# Altium schematic sheet [02] - BLOCK DIAGRAM.SchDoc: BLOCK DIAGRAM
size 433 x 279 mm; Author: ZAG; DrawnBy: ZAG; DocumentNumber: 3; SheetNumber: 2; SheetTotal: 7; PageSetup: Record=PageOptions|CenterHorizontal=True|CenterVertical=True|PrintScale=0.96|XCorrection=1.00|YCorrection=1.00|PrintKind=2|BorderSize=5000000|LeftOffset=0|BottomOffset=0|Orientation=2|PaperLength=4318|PaperWidth=2794|Scale=100|PaperSource=15|PrintQuality=600|MediaType=1|DitherType=10|PaperKind=11x17|PrintScaleMode=1; SchRevision: 01; PCBRevision: 01; Project: YOUTUBE SUBSCRIBER COUNTER; SchStatus: PRELIMINARY; ClientCompanyName: Mule Labs, LLC; ClientContactEmail: zack@mule-labs.com
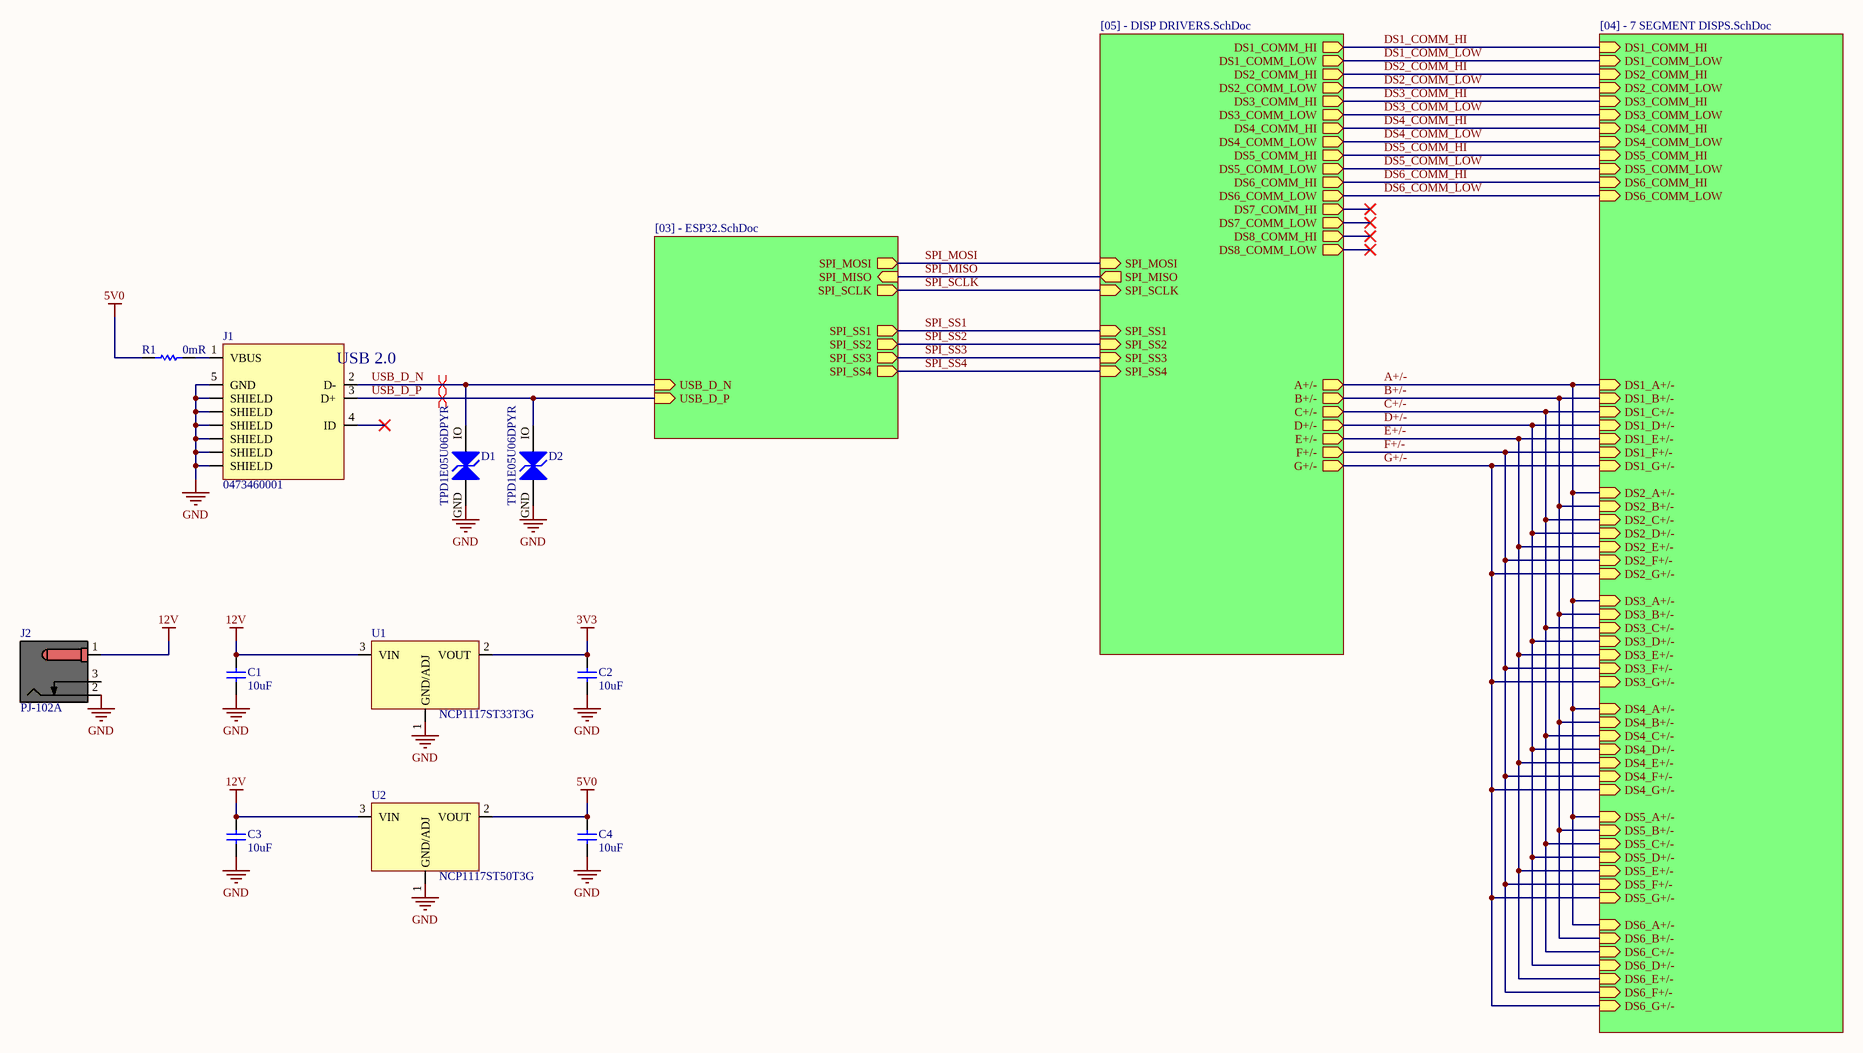
[diagram p0: [02] - BLOCK DIAGRAM.SchDoc]

## Parts
C1  10uF  [INCH 0805 - METRIC 2012 - H140]
C2  10uF  [INCH 0805 - METRIC 2012 - H140]
C3  10uF  [INCH 0805 - METRIC 2012 - H140]
C4  10uF  [INCH 0805 - METRIC 2012 - H140]
D1  TPD1E05U06DPYR  [DIODFN100X60X50-2]
D2  TPD1E05U06DPYR  [DIODFN100X60X50-2]
J1  0473460001  [MOLEX_047346-0001]
J2  PJ-102A  [CUI_PJ-102A]
R1  0mR  [INCH 0603 - METRIC 1508 - H050]
U1  NCP1117ST33T3G  [SOT223-4P230_700X180L90X70]
U2  NCP1117ST50T3G  [SOT223-4P230_700X180L90X70]

## Sub-sheets
7 Segment Displays = [04] - 7 SEGMENT DISPS.SchDoc: DS1_G+/- (in), DS1_F+/- (in), DS3_G+/- (in), DS4_G+/- (in), DS1_A+/- (in), DS5_D+/- (in), DS2_D+/- (in), DS6_A+/- (in), DS5_G+/- (in), DS6_C+/- (in), DS6_E+/- (in), DS1_E+/- (in), DS2_A+/- (in), DS3_B+/- (in), DS6_G+/- (in), DS6_F+/- (in), DS2_E+/- (in), DS4_F+/- (in), DS4_B+/- (in), DS6_D+/- (in), DS4_E+/- (in), DS3_A+/- (in), DS3_F+/- (in), DS5_C+/- (in), DS2_G+/- (in), DS2_F+/- (in), DS3_C+/- (in), DS6_B+/- (in), DS1_B+/- (in), DS2_C+/- (in), DS3_D+/- (in), DS3_E+/- (in), DS1_C+/- (in), DS5_F+/- (in), DS5_B+/- (in), DS5_A+/- (in), DS5_E+/- (in), DS2_B+/- (in), DS4_A+/- (in), DS1_D+/- (in), DS4_C+/- (in), DS4_D+/- (in), DS2_COMM_HI (in), DS5_COMM_HI (in), DS1_COMM_HI (in), DS4_COMM_LOW (in), DS1_COMM_LOW (in), DS3_COMM_LOW (in), DS4_COMM_HI (in), DS5_COMM_LOW (in), DS6_COMM_HI (in), DS2_COMM_LOW (in), DS6_COMM_LOW (in), DS3_COMM_HI (in)
Display Drivers = [05] - DISP DRIVERS.SchDoc: SPI_SS3 (in), SPI_SS4 (in), SPI_MOSI (in), SPI_SS1 (in), SPI_SCLK (in), SPI_MISO (out), SPI_SS2 (in), G+/- (out), B+/- (out), C+/- (out), F+/- (out), A+/- (out), E+/- (out), D+/- (out), DS5_COMM_LOW (out), DS3_COMM_LOW (out), DS6_COMM_LOW (out), DS7_COMM_HI (out), DS3_COMM_HI (out), DS2_COMM_LOW (out), DS4_COMM_HI (out), DS5_COMM_HI (out), DS8_COMM_HI (out), DS2_COMM_HI (out), DS8_COMM_LOW (out), DS7_COMM_LOW (out), DS6_COMM_HI (out), DS1_COMM_LOW (out), DS4_COMM_LOW (out), DS1_COMM_HI (out)
ESP32 = [03] - ESP32.SchDoc: USB_D_N (in), USB_D_P (in), SPI_SS4 (out), SPI_SS3 (out), SPI_SS2 (out), SPI_SS1 (out), SPI_SCLK (out), SPI_MISO (in), SPI_MOSI (out)

## Nets
3V3: C2.1 U1.2(VOUT)
5V0: C4.1 R1.1 U2.2(VOUT)
12V: C1.1 C3.1 J2.1 U1.3(VIN) U2.3(VIN)
GND: C1.2 C2.2 C3.2 C4.2 D1.GND D2.GND J1.0(SHIELD) J1.5(GND) J2.2 U1.1(GND/ADJ) U2.1(GND/ADJ)
A+/-: sheet Display Drivers/A+/-, sheet 7 Segment Displays/DS1_A+/-, sheet 7 Segment Displays/DS6_A+/-, sheet 7 Segment Displays/DS2_A+/-, sheet 7 Segment Displays/DS3_A+/-, sheet 7 Segment Displays/DS5_A+/-, sheet 7 Segment Displays/DS4_A+/-
B+/-: sheet Display Drivers/B+/-, sheet 7 Segment Displays/DS3_B+/-, sheet 7 Segment Displays/DS4_B+/-, sheet 7 Segment Displays/DS6_B+/-, sheet 7 Segment Displays/DS1_B+/-, sheet 7 Segment Displays/DS5_B+/-, sheet 7 Segment Displays/DS2_B+/-
C+/-: sheet Display Drivers/C+/-, sheet 7 Segment Displays/DS6_C+/-, sheet 7 Segment Displays/DS5_C+/-, sheet 7 Segment Displays/DS3_C+/-, sheet 7 Segment Displays/DS2_C+/-, sheet 7 Segment Displays/DS1_C+/-, sheet 7 Segment Displays/DS4_C+/-
D+/-: sheet Display Drivers/D+/-, sheet 7 Segment Displays/DS5_D+/-, sheet 7 Segment Displays/DS2_D+/-, sheet 7 Segment Displays/DS6_D+/-, sheet 7 Segment Displays/DS3_D+/-, sheet 7 Segment Displays/DS1_D+/-, sheet 7 Segment Displays/DS4_D+/-
DS1_COMM_HI: sheet Display Drivers/DS1_COMM_HI, sheet 7 Segment Displays/DS1_COMM_HI
DS1_COMM_LOW: sheet Display Drivers/DS1_COMM_LOW, sheet 7 Segment Displays/DS1_COMM_LOW
DS2_COMM_HI: sheet Display Drivers/DS2_COMM_HI, sheet 7 Segment Displays/DS2_COMM_HI
DS2_COMM_LOW: sheet Display Drivers/DS2_COMM_LOW, sheet 7 Segment Displays/DS2_COMM_LOW
DS3_COMM_HI: sheet Display Drivers/DS3_COMM_HI, sheet 7 Segment Displays/DS3_COMM_HI
DS3_COMM_LOW: sheet Display Drivers/DS3_COMM_LOW, sheet 7 Segment Displays/DS3_COMM_LOW
DS4_COMM_HI: sheet Display Drivers/DS4_COMM_HI, sheet 7 Segment Displays/DS4_COMM_HI
DS4_COMM_LOW: sheet Display Drivers/DS4_COMM_LOW, sheet 7 Segment Displays/DS4_COMM_LOW
DS5_COMM_HI: sheet Display Drivers/DS5_COMM_HI, sheet 7 Segment Displays/DS5_COMM_HI
DS5_COMM_LOW: sheet Display Drivers/DS5_COMM_LOW, sheet 7 Segment Displays/DS5_COMM_LOW
DS6_COMM_HI: sheet Display Drivers/DS6_COMM_HI, sheet 7 Segment Displays/DS6_COMM_HI
DS6_COMM_LOW: sheet Display Drivers/DS6_COMM_LOW, sheet 7 Segment Displays/DS6_COMM_LOW
E+/-: sheet Display Drivers/E+/-, sheet 7 Segment Displays/DS6_E+/-, sheet 7 Segment Displays/DS1_E+/-, sheet 7 Segment Displays/DS2_E+/-, sheet 7 Segment Displays/DS4_E+/-, sheet 7 Segment Displays/DS3_E+/-, sheet 7 Segment Displays/DS5_E+/-
F+/-: sheet Display Drivers/F+/-, sheet 7 Segment Displays/DS1_F+/-, sheet 7 Segment Displays/DS6_F+/-, sheet 7 Segment Displays/DS4_F+/-, sheet 7 Segment Displays/DS3_F+/-, sheet 7 Segment Displays/DS2_F+/-, sheet 7 Segment Displays/DS5_F+/-
G+/-: sheet Display Drivers/G+/-, sheet 7 Segment Displays/DS1_G+/-, sheet 7 Segment Displays/DS3_G+/-, sheet 7 Segment Displays/DS4_G+/-, sheet 7 Segment Displays/DS5_G+/-, sheet 7 Segment Displays/DS6_G+/-, sheet 7 Segment Displays/DS2_G+/-
SPI_MISO: sheet ESP32/SPI_MISO, sheet Display Drivers/SPI_MISO
SPI_MOSI: sheet ESP32/SPI_MOSI, sheet Display Drivers/SPI_MOSI
SPI_SCLK: sheet ESP32/SPI_SCLK, sheet Display Drivers/SPI_SCLK
SPI_SS1: sheet ESP32/SPI_SS1, sheet Display Drivers/SPI_SS1
SPI_SS2: sheet ESP32/SPI_SS2, sheet Display Drivers/SPI_SS2
SPI_SS3: sheet ESP32/SPI_SS3, sheet Display Drivers/SPI_SS3
SPI_SS4: sheet ESP32/SPI_SS4, sheet Display Drivers/SPI_SS4
USB_D_N: D1.IO J1.2(D-) ; sheet ESP32/USB_D_N
USB_D_P: D2.IO J1.3(D+) ; sheet ESP32/USB_D_P
NetJ1_1: J1.1(VBUS) R1.2

Not connected (* = marked no-connect by the designer): J1 4(ID)*; J2 3

## Layout directives
differential pair; differential pair class DIFF90: USB_D_N, USB_D_P

## Notes on the sheet
- SHEET TITLE
- SCH REV:
- PROJECT NAME
- PCB REV:
- DATE:
- DRAWN BY
- CONTACT
- MANUFACTURER, OR SALE OF PROCESSES OR PRODUCTS WITHOUT THE EXPRESSED WRITTEN CONSENT OF
- THE INFORMATION CONTAINED HEREIN IS DEEMED TO BE CONFIDENTIAL, PROPRIETARY, AND A TRADE SECRET OF
- THIS INFORMATION MAY NOT BE USED, REPRODUCED, OR DISCLOSED AS THE DIRECT OR INDIRECT BASIS FOR THE DEVELOPMENT,
- SHEET
- MULE LABS, LLC
- www.mule-labs.com <http://www.mule-labs.com>
- OF
- SIZE: B
- DO NOT SCALE DRAWING
- (in symbol 0473460001) USB 2.0

## Library data of the parts
C1-C4 = GRM21BR61E106MA73L: CAP CER 10UF 25V X5R 0805; Manufacturer: Murata; Tolerance: 20%; Supplier 1: Digi-Key; Manufacturer Part Number: GRM21BR61E106MA73L; Stock 1: 30000; Pricing 1: 1=0.27, 10=0.184, 100=0.1044, 500=0.0737, 1000=0.06449 (USD); Mount: Surface Mount; Case/Package: 0805; Weight: 0.000335oz; Case Code (Metric): 2012; Case Code (Imperial): 0805; Min Operating Temperature: -55°C; Max Operating Temperature: 85°C; Capacitance: 10uF; Packaging: Tape and Reel; Dielectric: X5R; Voltage Rating: 25V; Termination: SMD/SMT; Composition: Ceramic; Voltage Rating (DC): 25V; Package Quantity: 3000; Length: 2mm; Height: 1.25mm; Width: 0.049inch; Thickness: 0.055inch; Depth: 1.25mm; REACH SVHC: No SVHC; Lead Free: Lead Free; Supplier Part Number 1: 490-10748-1-ND
D1 D2 = TPD1E05U06DPYR: TVS DIODE 5.5VWM 14VC 2X2SON; Manufacturer: Texas Instruments; Operating Supply Voltage: 5.5V; Capacitance: 0.5pF; Direction: Unidirectional; Number of Bidirectional Channels: 1; Min Breakdown Voltage: 6V; Clamping Voltage: 14V; Peak Pulse Power: 40W; Power Line Protection: Yes; Breakdown Voltage: 6.5V; Polarity: Bidirectional; Leakage Current: 10nA; Element Configuration: Single; Peak Pulse Current: 2.5A; Interface: LVDS,USB,Ethernet,HDMI,PCIe,SATA; Supplier 1: Digi-Key; Manufacturer Part Number: TPD1E05U06DPYR; Stock 1: 239066; Pricing 1: 1=0.5, 10=0.372, 100=0.2107, 500=0.13952, 1000=0.10696 (USD); Mount: Surface Mount; Number of Pins: 2; Min Operating Temperature: -40°C; Max Operating Temperature: 125°C; Packaging: Tape and Reel; Package Quantity: 10000; Reverse Standoff Voltage: 5.5V; Number of Channels: 1; Termination: SMD/SMT; Working Voltage: 5.5V; Max Power Dissipation: 40W; Length: 1.1mm; Radiation Hardening: No; REACH SVHC: No SVHC; Lead Free: Lead Free; ComponentLink1URL: https://datasheet.ciiva.com/12545/tpd1e05u06-224685-12545140.pdf; ComponentLink1Description: https://datasheet.ciiva.com/12545/tpd1e05u06-224685-12545140.pdf; ComponentLink2URL: https://datasheet.ciiva.com/26918/getdatasheetpartid-700473-26918022.pdf; ComponentLink2Description: https://datasheet.ciiva.com/26918/getdatasheetpartid-700473-26918022.pdf; ComponentLink3URL: https://datasheet.ciiva.com/6574/tpd1e05u06-6574667.pdf; ComponentLink3Description: https://datasheet.ciiva.com/6574/tpd1e05u06-6574667.pdf; Supplier Part Number 1: 296-39341-1-ND; Category: ESD Device
J1 = 0473460001: Conn Micro USB Type B RCP 5 POS 0.65mm Solder RA SMD 5 Terminal 1 Port Embossed T/R; Manufacturer: Molex; Number of Contacts: 5; Gender: Receptacle; Number of Ports: 1; Max Voltage Rating (AC): 30V; Supplier 1: Digi-Key; Manufacturer Part Number: 0473460001; Stock 1: 27309; Pricing 1: 1=1, 10=0.877, 25=0.8252, 50=0.7906, 100=0.7563, 250=0.68752, 500=0.61876, 1000=0.55 (USD); Mount: Surface Mount,Horizontal; Contact Material: Copper Alloy; Contact Plating: Nickel,Gold; Housing Material: Polymer; Number of Terminals: 5; Min Operating Temperature: -30°C; Max Operating Temperature: 85°C; Packaging: Tape and Reel; Orientation: Right Angle; Package Quantity: 1; Termination: Solder; Connector Type: USB; Length: 7.8mm; Pitch: 0.65mm; Depth: 5.43mm; Radiation Hardening: No; ComponentLink1URL: https://datasheet.ciiva.com/6731/473460001-sd-6731041.pdf; ComponentLink1Description: https://datasheet.ciiva.com/6731/473460001-sd-6731041.pdf; ComponentLink2URL: https://datasheet.ciiva.com/16545/0473460001-io-connectors-16545778.pdf; ComponentLink2Description: https://datasheet.ciiva.com/16545/0473460001-io-connectors-16545778.pdf; ComponentLink3URL: https://datasheet.ciiva.com/3094/0473460001-io-connectors-3094381.pdf; ComponentLink3Description: https://datasheet.ciiva.com/3094/0473460001-io-connectors-3094381.pdf; Supplier Part Number 1: WM17141CT-ND; Category: Connector
J2 = PJ-102A: PJ-102 Series 2 x 6.5 mm 16 V Horizontal Power Jack w/ Tapered PC Pins; Manufacturer: CUI; Gender: Male; Shielding: Unshielded; Current Rating: 2.5A; Voltage Rating: 24V; Insulation Resistance: 50MR; Number of Conductors: 2; Supplier 1: Digi-Key; Manufacturer Part Number: PJ-102A; RoHS: Yes; Stock 1: 105775; Pricing 1: 1 = 0.64000, 10 = 0.60000, 25 = 0.54000, 50 = 0.48000, 100 = 0.46000, 280 = 0.42000, 560 = 0.40000, 1120 = 0.33000, 2520 = 0.30000 (USD); Mount: Through Hole; Color: Black; Contact Material: Copper; Contact Plating: Nickel; Housing Color: Black; Housing Material: Thermoplastic; Min Operating Temperature: -25°C; Max Operating Temperature: 85°C; Package Quantity: 280; Termination: Through Hole; Connector Type: Jack; Contact Gender: Male; Orientation: Horizontal; Packaging: Bulk; Diameter: 2.1mm; Lead Free: Lead Free; Flammability Rating: UL94 V-0; Supplier Part Number 1: CP-102A-ND
R1 = ERJ-3GEY0R00V: RES SMD 0 OHM JUMPER 1/10W 0603; Manufacturer: Panasonic; Power Rating: 100mW; Voltage Rating: 75V; Tolerance: 0%; Temperature Coefficient: 600ppm/°C; Voltage Rating (DC): 50V; Supplier 1: Digi-Key; Manufacturer Part Number: ERJ-3GEY0R00V; Stock 1: 29334421; Pricing 1: 1=0.1, 10=0.04, 25=0.0292, 50=0.0222, 100=0.0164, 250=0.01252, 500=0.01002, 1000=0.00737 (USD); Mount: Surface Mount; Case/Package: 0603; Contact Plating: Tin; Case Code (Metric): 1608; Case Code (Imperial): 0603; Min Operating Temperature: -55°C; Max Operating Temperature: 155°C; Resistance: 0mR; Composition: Thick Film; Packaging: Tape and Reel; Package Quantity: 1; Number of Terminations: 2; Termination: SMD/SMT; Military Standard: Not; Max Power Dissipation: 100mW; Length: 1.6mm; Height: 0.45mm; Width: 0.031inch; Depth: 0.8mm; Radiation Hardening: No; REACH SVHC: No SVHC; Lead Free: Lead Free; ComponentLink1URL: https://datasheet.ciiva.com/48532/aoa0000ce1-48532165.pdf; ComponentLink1Description: https://datasheet.ciiva.com/48532/aoa0000ce1-48532165.pdf; ComponentLink2URL: https://datasheet.ciiva.com/43460/1678796-43460647.pdf; ComponentLink2Description: https://datasheet.ciiva.com/43460/1678796-43460647.pdf; ComponentLink3URL: https://datasheet.ciiva.com/27055/1935748-27055113.pdf; ComponentLink3Description: https://datasheet.ciiva.com/27055/1935748-27055113.pdf; ComponentLink4URL: https://datasheet.ciiva.com/28695/1678796-28695833.pdf; ComponentLink4Description: https://datasheet.ciiva.com/28695/1678796-28695833.pdf; ComponentLink5URL: https://datasheet.ciiva.com/5959/1678796-5959707.pdf; ComponentLink5Description: https://datasheet.ciiva.com/5959/1678796-5959707.pdf; ComponentLink6URL: https://datasheet.ciiva.com/16834/aoa0000ce1-16834828.pdf; ComponentLink6Description: https://datasheet.ciiva.com/16834/aoa0000ce1-16834828.pdf; ComponentLink7URL: https://datasheet.ciiva.com/17215/aoa0000ce1-17215388.pdf; ComponentLink7Description: https://datasheet.ciiva.com/17215/aoa0000ce1-17215388.pdf; ComponentLink8URL: https://datasheet.ciiva.com/46377/1678796-46377868.pdf; ComponentLink8Description: https://datasheet.ciiva.com/46377/1678796-46377868.pdf; ComponentLink9URL: https://datasheet.ciiva.com/30199/4aoa0000ce1-30199822.pdf; ComponentLink9Description: https://datasheet.ciiva.com/30199/4aoa0000ce1-30199822.pdf; ComponentLink10URL: https://datasheet.ciiva.com/9198/aoa0000ce1-9198975.pdf; ComponentLink10Description: https://datasheet.ciiva.com/9198/aoa0000ce1-9198975.pdf; ComponentLink11URL: https://datasheet.ciiva.com/11808/0900766b80f806dd-11808207.pdf; ComponentLink11Description: https://datasheet.ciiva.com/11808/0900766b80f806dd-11808207.pdf; ComponentLink12URL: https://datasheet.ciiva.com/16758/70255313-16758527.pdf; ComponentLink12Description: https://datasheet.ciiva.com/16758/70255313-16758527.pdf; Supplier Part Number 1: P0.0GCT-ND; Category: Resistor
U1 = NCP1117ST33T3G: IC REG LINEAR 3.3V 1A SOT223; Manufacturer: ON Semiconductor; Max Input Voltage: 20V; Number of Outputs: 1; Dropout Voltage: 1.07V; Max Supply Voltage: 15V; Min Supply Voltage: 4.75V; Min Input Voltage: 3.5V; Input Bias Current: 6mA; Quiescent Current: 10mA; Polarity: Positive; Reference Voltage: 1.25V; Accuracy: 1%; Output Type: Fixed; Supplier 1: Digi-Key; Manufacturer Part Number: NCP1117ST33T3G; RoHS: Yes; Stock 1: 60671; Pricing 1: 1 = 0.52000, 10 = 0.44400, 100 = 0.33150, 500 = 0.26048, 1000 = 0.20129 (USD); Mount: Surface Mount; Case/Package: SOT-223; Number of Pins: 3; Contact Plating: Tin; Min Operating Temperature: 0°C; Max Operating Temperature: 125°C; Output Voltage: 3.3V; Packaging: Tape and Reel; Output Current: 1A; Max Output Current: 1A; Package Quantity: 1; Nominal Output Voltage: 3.3V; Number of Regulators: 1; Min Current Limit: 1A; Min Output Voltage: 3.3V; Max Output Voltage: 3.3V; Termination: SMD/SMT; Output Voltage Accuracy: 1%; Length: 6.7mm; Height: 1.69mm; Width: 3.7mm; Radiation Hardening: No; REACH SVHC: No SVHC; Lead Free: Lead Free; Halogen Free: Halogen Free; ComponentLink1URL: https://datasheet.ciiva.com/3224/ncp1117-d-3224144.pdf?src-supplier=Avnet; ComponentLink1Description: https://datasheet.ciiva.com/3224/ncp1117-d-3224144.pdf?src-supplier=Avnet; ComponentLink2URL: https://datasheet.ciiva.com/22697/1726422-22697602.pdf?src-supplier=Element14; ComponentLink2Description: https://datasheet.ciiva.com/22697/1726422-22697602.pdf?src-supplier=Element14; ComponentLink3URL: https://datasheet.ciiva.com/15111/getdatasheetpartid-82718-15111483.pdf?src-supplier=Verical; ComponentLink3Description: https://datasheet.ciiva.com/15111/getdatasheetpartid-82718-15111483.pdf?src-supplier=Verical; ComponentLink4URL: https://datasheet.ciiva.com/8233/ncp1117-d-8233589.pdf?src-supplier=Avnet; ComponentLink4Description: https://datasheet.ciiva.com/8233/ncp1117-d-8233589.pdf?src-supplier=Avnet; ComponentLink5URL: https://datasheet.ciiva.com/2042/ncp1117-d-2042027.pdf?src-supplier=Digi-Key; ComponentLink5Description: https://datasheet.ciiva.com/2042/ncp1117-d-2042027.pdf?src-supplier=Digi-Key; ComponentLink6URL: https://datasheet.ciiva.com/2042/ncp1117-d-2042028.pdf?src-supplier=Digi-Key; ComponentLink6Description: https://datasheet.ciiva.com/2042/ncp1117-d-2042028.pdf?src-supplier=Digi-Key; ComponentLink7URL: https://datasheet.ciiva.com/2042/ncp1117-d-2042029.pdf?src-supplier=Digi-Key; ComponentLink7Description: https://datasheet.ciiva.com/2042/ncp1117-d-2042029.pdf?src-supplier=Digi-Key; ComponentLink8URL: https://datasheet.ciiva.com/8073/1726422-8073735.pdf?src-supplier=Element14; ComponentLink8Description: https://datasheet.ciiva.com/8073/1726422-8073735.pdf?src-supplier=Element14; ComponentLink9URL: https://datasheet.ciiva.com/28483/1748260-28483307.pdf?src-supplier=Element14; ComponentLink9Description: https://datasheet.ciiva.com/28483/1748260-28483307.pdf?src-supplier=Element14; ComponentLink10URL: https://datasheet.ciiva.com/16382/ncp1117-d-16382636.pdf?src-supplier=Future+Electronics; ComponentLink10Description: https://datasheet.ciiva.com/16382/ncp1117-d-16382636.pdf?src-supplier=Future+Electronics; Supplier Part Number 1: NCP1117ST33T3GOSCT-ND
U2 = NCP1117ST50T3G: IC REG LINEAR 5V 1A SOT223; Manufacturer: ON Semiconductor; Number of Outputs: 1; Max Input Voltage: 20V; Min Input Voltage: 3.5V; Dropout Voltage: 1.2V; Input Bias Current: 6mA; Polarity: Positive; Quiescent Current: 10mA; Output Voltage Accuracy: 1%; Power Rating: 781mW; Output Type: Fixed; Supplier 1: Digi-Key; Manufacturer Part Number: NCP1117ST50T3G; RoHS: Yes; Stock 1: 20727; Pricing 1: 1 = 0.54000, 10 = 0.45800, 100 = 0.34230, 500 = 0.26896, 1000 = 0.20783 (USD); Case/Package: SOT-223; Number of Pins: 4; Contact Plating: Tin; Min Operating Temperature: 0°C; Max Operating Temperature: 125°C; Package Quantity: 1; Output Voltage: 5V; Output Current: 1A; Max Output Current: 1A; Nominal Output Voltage: 5V; Packaging: Tape and Reel; Number of Regulators: 1; Min Current Limit: 1A; Accuracy: 1%; Tolerance: 1%; Length: 6.7mm; Height: 1.69mm; Width: 3.7mm; Radiation Hardening: No; REACH SVHC: No SVHC; Lead Free: Lead Free; Halogen Free: Halogen Free; ComponentLink1URL: https://datasheet.ciiva.com/28483/1748260-28483320.pdf?src-supplier=Element14; ComponentLink1Description: https://datasheet.ciiva.com/28483/1748260-28483320.pdf?src-supplier=Element14; ComponentLink2URL: https://datasheet.ciiva.com/2042/ncp1117-d-2042018.pdf?src-supplier=Digi-Key; ComponentLink2Description: https://datasheet.ciiva.com/2042/ncp1117-d-2042018.pdf?src-supplier=Digi-Key; ComponentLink3URL: https://datasheet.ciiva.com/2042/ncp1117-d-2042019.pdf?src-supplier=Digi-Key; ComponentLink3Description: https://datasheet.ciiva.com/2042/ncp1117-d-2042019.pdf?src-supplier=Digi-Key; ComponentLink4URL: https://datasheet.ciiva.com/2042/ncp1117-d-2042020.pdf?src-supplier=Digi-Key; ComponentLink4Description: https://datasheet.ciiva.com/2042/ncp1117-d-2042020.pdf?src-supplier=Digi-Key; ComponentLink5URL: https://datasheet.ciiva.com/25978/ncp1117-d-25978293.pdf?src-supplier=Avnet+Europe; ComponentLink5Description: https://datasheet.ciiva.com/25978/ncp1117-d-25978293.pdf?src-supplier=Avnet+Europe; ComponentLink6URL: https://datasheet.ciiva.com/16491/ncp1117-d-16491895.pdf?src-supplier=Avnet+Asia; ComponentLink6Description: https://datasheet.ciiva.com/16491/ncp1117-d-16491895.pdf?src-supplier=Avnet+Asia; ComponentLink7URL: https://datasheet.ciiva.com/8073/ncp1117-d-8073736.pdf?src-supplier=Element14; ComponentLink7Description: https://datasheet.ciiva.com/8073/ncp1117-d-8073736.pdf?src-supplier=Element14; ComponentLink8URL: https://datasheet.ciiva.com/8233/ncp1117-d-8233593.pdf?src-supplier=Avnet; ComponentLink8Description: https://datasheet.ciiva.com/8233/ncp1117-d-8233593.pdf?src-supplier=Avnet; ComponentLink9URL: https://datasheet.ciiva.com/16209/ncp1117-d-16209561.pdf?src-supplier=Future+Electronics; ComponentLink9Description: https://datasheet.ciiva.com/16209/ncp1117-d-16209561.pdf?src-supplier=Future+Electronics; ComponentLink10URL: https://datasheet.ciiva.com/8231/ncp1117-d-8231068.pdf?src-supplier=Avnet; ComponentLink10Description: https://datasheet.ciiva.com/8231/ncp1117-d-8231068.pdf?src-supplier=Avnet; ComponentLink11URL: https://datasheet.ciiva.com/8073/ncp1117-d-8073902.pdf?src-supplier=Element14; ComponentLink11Description: https://datasheet.ciiva.com/8073/ncp1117-d-8073902.pdf?src-supplier=Element14; Supplier Part Number 1: NCP1117ST50T3GOSCT-ND